# EAGLE design Top pHAT (EAGLE 9.5.2)
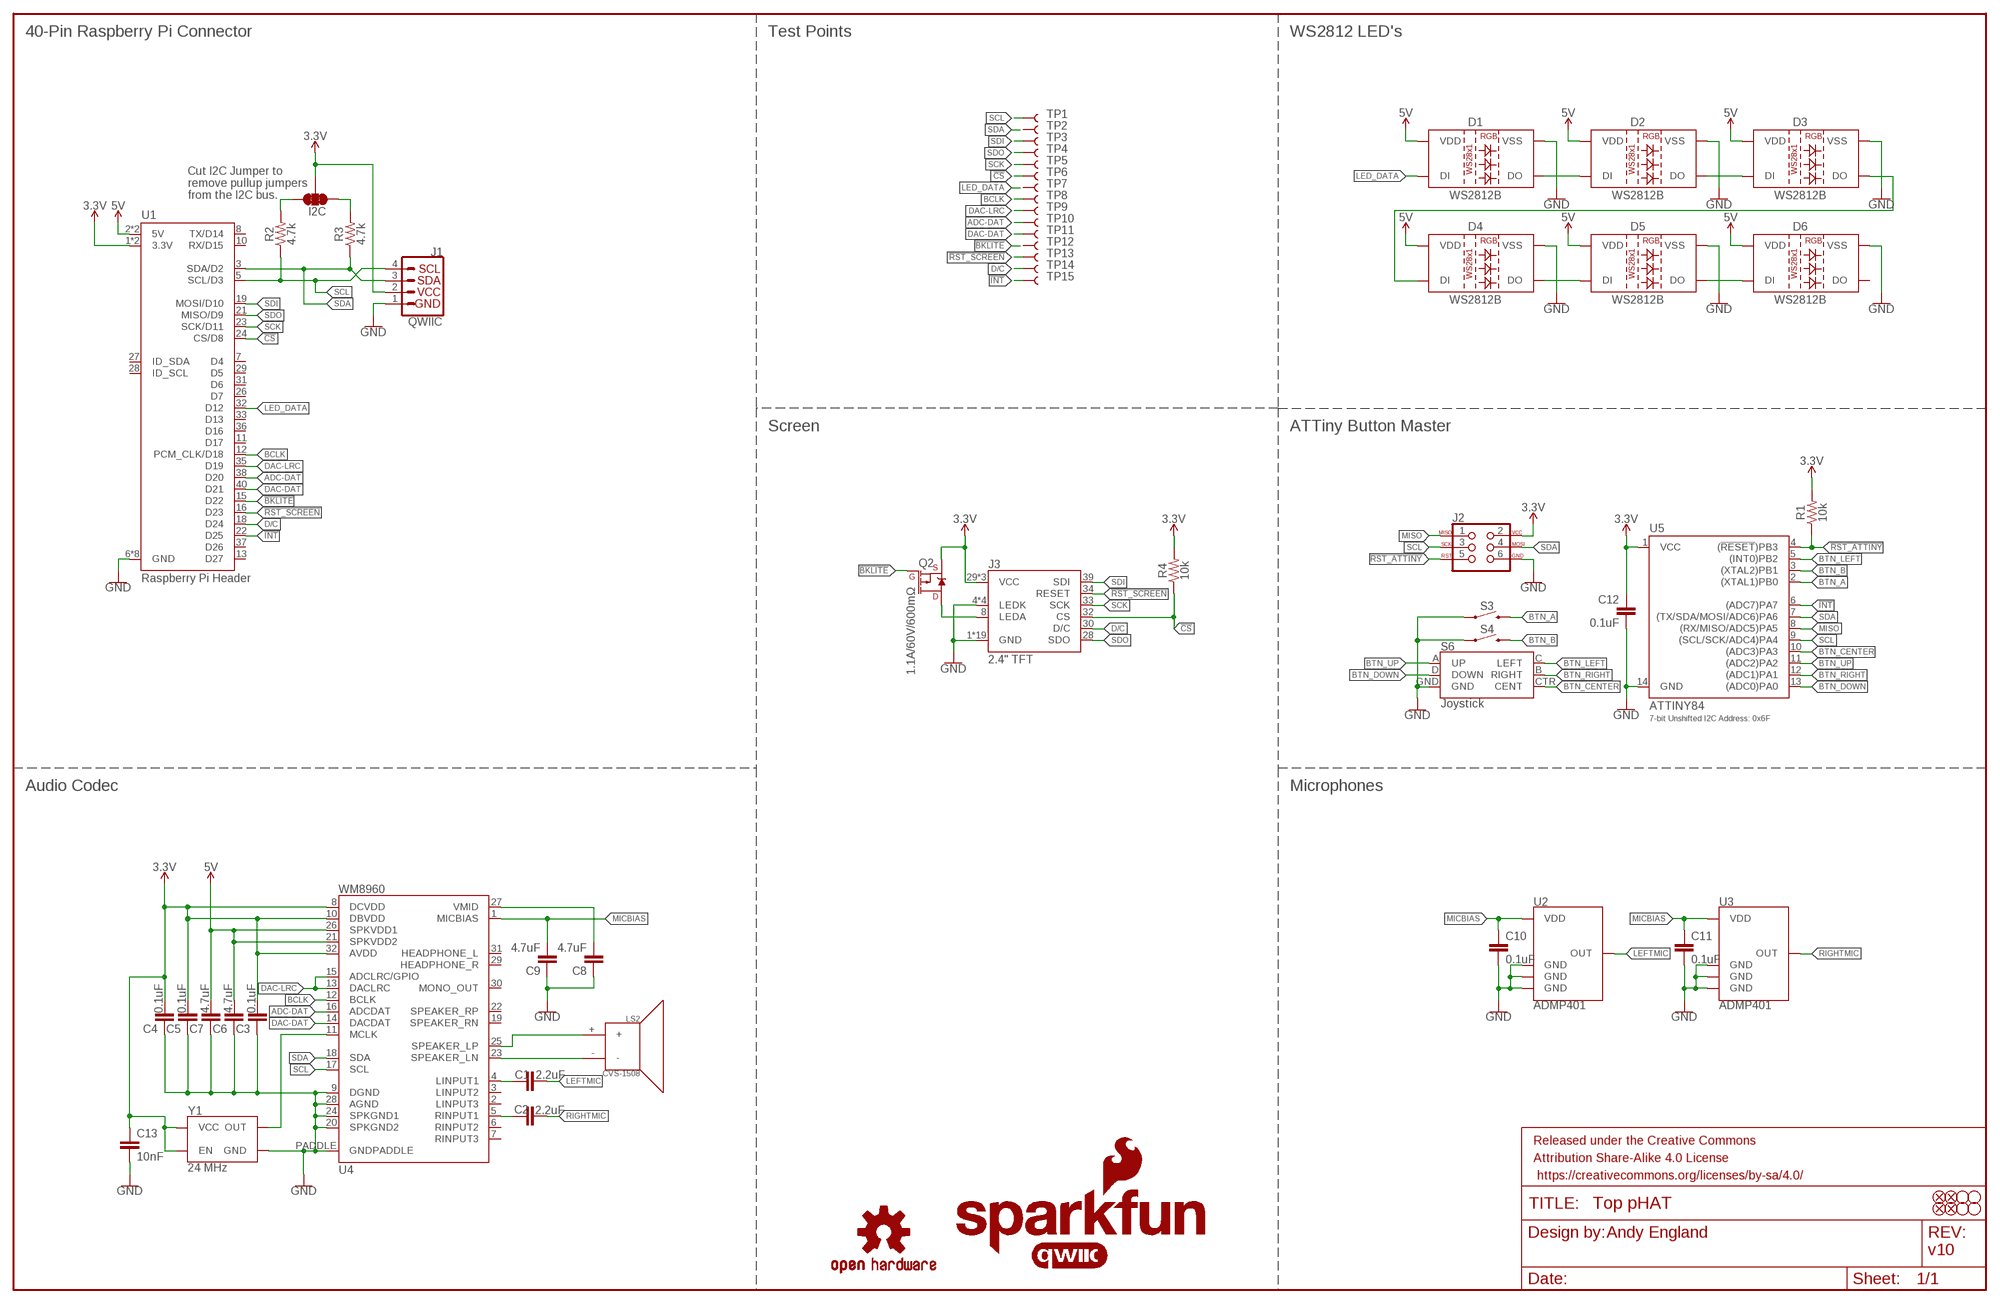
[diagram p0: schematic, sheet 1]

## Parts
C1  2.2uF  2.2UF-0603-10V-20%  [0603]
C2  2.2uF  2.2UF-0603-10V-20%  [0603]
C3  0.1uF  0.1UF-0603-25V-(+80/-20%)  [0603]
C4  0.1uF  0.1UF-0603-25V-(+80/-20%)  [0603]
C5  0.1uF  0.1UF-0603-25V-(+80/-20%)  [0603]
C6  4.7uF  4.7UF-0603-6.3V-(10%)  [0603]
C7  4.7uF  4.7UF-0603-6.3V-(10%)  [0603]
C8  4.7uF  4.7UF-0603-6.3V-(10%)  [0603]
C9  4.7uF  4.7UF-0603-6.3V-(10%)  [0603]
C10  0.1uF  0.1UF-0603-25V-(+80/-20%)  [0603]
C11  0.1uF  0.1UF-0603-25V-(+80/-20%)  [0603]
C12  0.1uF  0.1UF-0603-25V-(+80/-20%)  [0603]
C13  10nF  10NF-0603-50V-10%  [0603]
D1  WS2812B  [WS2812B]
D2  WS2812B  [WS2812B]
D3  WS2812B  [WS2812B]
D4  WS2812B  [WS2812B]
D5  WS2812B  [WS2812B]
D6  WS2812B  [WS2812B]
FD1  FIDUCIAL1X2  [FIDUCIAL-1X2]
FD2  FIDUCIAL1X2  [FIDUCIAL-1X2]
FD3  FIDUCIAL1X2  [FIDUCIAL-1X2]
FD4  FIDUCIAL1X2  [FIDUCIAL-1X2]
FRAME1  FRAME-LEDGER  [CREATIVE_COMMONS]
H1  STAND-OFFTIGHT  [STAND-OFF-TIGHT]
H2  STAND-OFFTIGHT  [STAND-OFF-TIGHT]
H3  STAND-OFFTIGHT  [STAND-OFF-TIGHT]
H4  STAND-OFFTIGHT  [STAND-OFF-TIGHT]
I2C  JUMPER-SMT_3_2-NC_TRACE_NO-SILK  [SMT-JUMPER_3_2-NC_TRACE_NO-SILK]
J1  QWIIC  QWIIC_CONNECTORJS-1MM  [JST04_1MM_RA]
J2  AVR_SPI_PROG_3X2TESTPOINTS  [2X3_TEST_POINTS]
J3  2.4" TFT  4DLCD-24-320X240  [FPC05040-17204]
LOGO2  SFE_LOGO_NAME_FLAME.4_INCH  [SFE_LOGO_NAME_FLAME_.4]
LOGO3  QWIIC_LOGO_4MM  [QWIIC_4MM]
LOGO4  OSHW-LOGOS  [OSHW-LOGO-S]
LS2  CVS-1508  SPEAKERCVS-1508  [CVS-1508_PCBSPKR]
Q2  1.1A/60V/600mΩ  MOSFET_PCH-SI2309DS  [SOT23-3]
R1  10k  10KOHM-0603-1/10W-1%  [0603]
R2  4.7k  4.7KOHM-0603-1/10W-1%  [0603]
R3  4.7k  4.7KOHM-0603-1/10W-1%  [0603]
R4  10k  10KOHM-0603-1/10W-1%  [0603]
S3  MOMENTARY-SWITCH-SPST-SMD-5.2MM-TALL  [TACTILE_SWITCH_SMD_5.2MM]
S4  MOMENTARY-SWITCH-SPST-SMD-5.2MM-TALL  [TACTILE_SWITCH_SMD_5.2MM]
S6  Joystick  JOYSTICK_MINI  [JOYSTICK_MINI]
TP1  TEST-POINT3X5  [PAD.03X.05]
TP2  TEST-POINT3X5  [PAD.03X.05]
TP3  TEST-POINT3X5  [PAD.03X.05]
TP4  TEST-POINT3X5  [PAD.03X.05]
TP5  TEST-POINT3X5  [PAD.03X.05]
TP6  TEST-POINT3X5  [PAD.03X.05]
TP7  TEST-POINT3X5  [PAD.03X.05]
TP8  TEST-POINT3X5  [PAD.03X.05]
TP9  TEST-POINT3X5  [PAD.03X.05]
TP10  TEST-POINT3X5  [PAD.03X.05]
TP11  TEST-POINT3X5  [PAD.03X.05]
TP12  TEST-POINT3X5  [PAD.03X.05]
TP13  TEST-POINT3X5  [PAD.03X.05]
TP14  TEST-POINT3X5  [PAD.03X.05]
TP15  TEST-POINT3X5  [PAD.03X.05]
U1  Raspberry Pi Header  RASPBERRY_PI_40BTM-NOHOLES  [RASPBERRY_PI_SHIELD_BOTTOM_ENTRY_NOHOLES]
U2  ADMP401  [ADMP401]
U3  ADMP401  [ADMP401]
U4  WM8960  [QFN-32]
U5  ATTINY84  [SO14]
Y1  24 MHz  OSCILLATOR-24MHZ  [RESONATOR-SMD-3.2X2.5]

## Nets
3.3V: C3.2 C4.2 C5.2 C12.1 C13.1 I2C.2 J1.2 J2.2 J3.29(VCC) J3.31(VCC) J3.38(VCC) Q2.2(S) R1.2 R4.2 U1.1(3.3V) U1.17(3.3V) U4.8(DCVDD) U4.10(DBVDD) U4.32(AVDD) U5.1(VCC) Y1.1(EN) Y1.4(VCC)
5V: C6.2 C7.2 D1.1(VDD) D2.1(VDD) D3.1(VDD) D4.1(VDD) D5.1(VDD) D6.1(VDD) U1.2(5V) U1.4(5V) U4.21(SPKVDD2) U4.26(SPKVDD1)
!BKLITE: Q2.1(G) TP12.P$1 U1.15(D22)
!CS: J3.32(CS) R4.1 TP6.P$1 U1.24(CS/D8)
!INT: TP15.P$1 U1.22(D25) U5.6((ADC7)PA7)
!RST_ATTINY: J2.5 R1.1 U5.4((!RESET!)PB3)
!RST_SCREEN: J3.34(RESET) TP13.P$1 U1.16(D23)
ADC-DAT: TP10.P$1 U1.38(D20) U4.16(ADCDAT)
BCLK: TP8.P$1 U1.12(PCM_CLK/D18) U4.12(BCLK)
BTN_A: S3.3 U5.2((XTAL1)PB0)
BTN_B: S4.3 U5.3((XTAL2)PB1)
BTN_CENTER: S6.CTR(CENT) U5.10((ADC3)PA3)
BTN_DOWN: S6.D(DOWN) U5.13((ADC0)PA0)
BTN_LEFT: S6.C(LEFT) U5.5((INT0)PB2)
BTN_RIGHT: S6.B(RIGHT) U5.12((ADC1)PA1)
BTN_UP: S6.A(UP) U5.11((ADC2)PA2)
D/C: J3.30(D/C) TP14.P$1 U1.18(D24)
DAC-DAT: TP11.P$1 U1.40(D21) U4.14(DACDAT)
DAC-LRC: TP9.P$1 U1.35(D19) U4.13(DACLRC) U4.15(ADCLRC/GPIO)
GND: C3.1 C4.1 C5.1 C6.1 C7.1 C8.1 C9.1 C10.2 C11.2 C12.2 C13.2 D1.3(VSS) D2.3(VSS) D3.3(VSS) D4.3(VSS) D5.3(VSS) D6.3(VSS) J1.1 J2.6 J3.1(GND) J3.4(LEDK) J3.5(LEDK) J3.6(LEDK) J3.7(LEDK) J3.11(GND) J3.12(GND) J3.13(GND) J3.14(GND) J3.15(GND) J3.16(GND) J3.17(GND) J3.18(GND) J3.19(GND) J3.20(GND) J3.21(GND) J3.22(GND) J3.23(GND) J3.24(GND) J3.25(GND) J3.26(GND) J3.27(GND) J3.40(GND) S3.1 S4.1 S6.GND U1.6(GND) U1.9(GND) U1.14(GND) U1.20(GND) U1.25(GND) U1.30(GND) U1.34(GND) U1.39(GND) U2.2(GND) U2.4(GND) U2.6(GND) U3.2(GND) U3.4(GND) U3.6(GND) U4.9(DGND) U4.20(SPKGND2) U4.24(SPKGND1) U4.28(AGND) U4.PADDLE(GNDPADDLE) U5.14(GND) Y1.2(GND)
LED_DATA: D1.4(DI) TP7.P$1 U1.32(D12)
LEFTMIC: C1.2 U2.1(OUT)
MICBIAS: C9.2 C10.1 C11.1 U2.5(VDD) U3.5(VDD) U4.1(MICBIAS)
MISO: J2.1 U5.8((RX/MISO/ADC5)PA5)
N$1: D3.2(DO) D4.4(DI)
N$2: D4.2(DO) D5.4(DI)
N$3: D5.2(DO) D6.4(DI)
N$4: J3.8(LEDA) Q2.3(D)
N$6: LS2.+ U4.25(SPEAKER_LP)
N$8: D1.2(DO) D2.4(DI)
N$9: D2.2(DO) D3.4(DI)
N$11: U4.11(MCLK) Y1.3(OUT)
N$16: I2C.3 R2.2
N$17: I2C.1 R3.2
N$22: LS2.- U4.23(SPEAKER_LN)
N$29: C1.1 U4.4(LINPUT1)
N$30: C2.1 U4.5(RINPUT1)
N$38: C8.2 U4.27(VMID)
RIGHTMIC: C2.2 U3.1(OUT)
SCK: J3.33(SCK) TP5.P$1 U1.23(SCK/D11)
SCL: J1.4 J2.3 R2.1 TP1.P$1 U1.5(SCL/D3) U4.17(SCL) U5.9((SCL/SCK/ADC4)PA4)
SDA: J1.3 J2.4 R3.1 TP2.P$1 U1.3(SDA/D2) U4.18(SDA) U5.7((TX/SDA/MOSI/ADC6)PA6)
SDI: J3.39(SDI) TP3.P$1 U1.19(MOSI/D10)
SDO: J3.28(SDO) TP4.P$1 U1.21(MISO/D9)
Unconnected: D6.2(DO) U1.7(D4) U1.8(TX/D14) U1.10(RX/D15) U1.11(D17) U1.13(D27) U1.26(D7) U1.27(ID_SDA) U1.28(ID_SCL) U1.29(D5) U1.31(D6) U1.33(D13) U1.36(D16) U1.37(D26) U4.2(LINPUT3) U4.3(LINPUT2) U4.6(RINPUT2) U4.7(RINPUT3) U4.19(SPEAKER_RN) U4.22(SPEAKER_RP) U4.29(HEADPHONE_R) U4.30(MONO_OUT) U4.31(HEADPHONE_L)

## Notes on the sheet
- 40-Pin Raspberry Pi Connector | Test Points | WS2812 LED's
- Cut I2C Jumper to 
  remove pullup jumpers 
  from the I2C bus.
- Screen | ATTiny Button Master
- 7-bit Unshifted I2C Address: 0x6F
- Audio Codec | Microphones
- Andy England
- v10

## Library data of the parts
C1 C2 = SparkFun-Capacitors:2.2UF: 2.2µF ceramic capacitors A capacitor is a passive two-terminal electrical component used to store electrical energy temporarily in an electric field.; PROD_ID: CAP-07888
C3-C5 C10-C12 = SparkFun-Capacitors:0.1UF: 0.1µF ceramic capacitors A capacitor is a passive two-terminal electrical component used to store electrical energy temporarily in an electric field.; PROD_ID: CAP-00810
C6-C9 = SparkFun-Capacitors:4.7UF: 4.7µF ceramic capacitors A capacitor is a passive two-terminal electrical component used to store electrical energy temporarily in an electric field.; PROD_ID: CAP-08280
C13 = SparkFun-Capacitors:10NF: 0.01uF/10nF/10,000pF ceramic capacitors A capacitor is a passive two-terminal electrical component used to store electrical energy temporarily in an electric field. CAP-09321; PROD_ID: CAP-00867
D1-D6 = SparkFun-LED:WS2812B: WS2812B SMD addressable RGB LED 5x5mm SMD LED with built-in controller IC. Color: Red/Green/Blue mC Rating: RGB: 390, 660, 180 mcd Forward Voltage: RGB: 2.0, 3.0, 3.0 V Packages:WS2812B SparkFun Products: Blynk Board - ESP8266 <https://www.sparkfun.com/products/13794>; PROD_ID: DIO-12503
FD1-FD4 = SparkFun-Aesthetics:FIDUCIAL: Fiducial Alignment Points Point-of-reference for pick-and-place machines and other optical instruments.
FRAME1 = SparkFun-Aesthetics:FRAME-LEDGER: Schematic Frame - Ledger Standard 11x14 US Ledger frame
H1-H4 = SparkFun-Hardware:STAND-OFF: Stand Off Drill holes for mechanically mounting via screws, standoffs, etc. Note: Use the keepout ring to avoid running the screw head into surrounding components. Variant Overviews STAND-OFF - Mechanical footprint for a #4 phillips button head screw. STAND-OFF-TIGHT - Mechanical footprint for a #4 phillips button head screw, Example SparkFun Products Screw - Phillips Head (1/4", 4-40, 10 pack) <https://www.sparkfun.com/products/10453> (PRT-10453) Screw - Phillips Head (1/2", 4-40, 10 pack) <https://www.sparkfun.com/products/10452> (PRT-10452) Screw - Phillips Head (3/4", 4-40, 10 pack) <https://www.sparkfun.com/products/10451> (PRT-10451) Screw - Phillips Head (1", 4-40, 10 pack) <https://www.sparkfun.com/products/10450> (PRT-10450)
I2C = SparkFun-Jumpers:JUMPER-SMT_3_2-NC_TRACE: Normally closed trace jumper (2 of 2 connections) This jumper has a trace between all three pads so they are normally closed (NC). Use a razor knife to open the connection(s). For best results follow the IPC guidelines for cutting traces: Cutout at least 0.063 mm (0.005 in). Remove all loose material to clean up the cut area. Seal the cut with an approved epoxy. Reapply solder to reclose the connection(s).
J1 = SparkFun-Connectors:QWIIC_CONNECTOR: SparkFun I2C Standard Qwiic Connector An SMD 1mm pitch JST connector makes it easy and quick (get it? Qwiic?) to connect I2C devices to each other. The Qwiic system <http://www.sparkfun.com/qwiic> enables fast and solderless connection between popular platforms and various sensors and actuators. We carry 200mm <https://www.sparkfun.com/products/14204>, 100mm <https://www.sparkfun.com/products/14205>, 50mm <https://www.sparkfun.com/products/14206>, and breadboard friendly <https://www.sparkfun.com/products/14207> Qwiic cables. We also offer 10 pcs strips <https://www.sparkfun.com/products/14323> the SMD connectors.; PROD_ID: CONN-13694; VALUE: QWIIC_RIGHT_ANGLE
J2 = SparkFun-Connectors:AVR_SPI_PROG_3X2: AVR ISP 6 Pin This is the reduced ISP connector for AVR programming. Common on Arduino. This footprint will take up less PCB space and can be used with a 10-pin to 6-pin adapter such as SKU: BOB-08508 **Special note about "TEST_POINT" package. The stop mask is on the top side, so if you want your programming test points to be on the bottom of your board, make sure to place this package on the bottom side of the board. This also ensure that the orientation to program from the bottom side will be correct. SparkFun Products: SparkFun ISP Pogo Adapter <https://www.sparkfun.com/products/11591> - NS Tiny AVR Programmer <https://www.sparkfun.com/products/11801> -PTH
J3 = SparkFun-Displays:4DLCD-24-320X240: 4D LCD 4DLCD-24320240-IPS - 2.4" 240x320 TFT LCD 4-wire SPI capable TFT display. 36.72 x 48.96mm active area; PROD_ID: LCD-14913; PROD_ID1: CONN-14082
LOGO2 = SparkFun-Aesthetics:SFE_LOGO_NAME_FLAME: SparkFun Font Logo w/ Flame This is the SparkFun full logo. The logo on the schematic will always be the same size; the package variant is the height of the flame part of the logo. Default layer for the logo on the board is tSilk.
LOGO3 = SparkFun-Aesthetics:QWIIC_LOGO: Qwiic Logos for placement on schematic and PCB. The 5.5mm silk logo is best for placing next to Qwiic connector.
LOGO4 = SparkFun-Aesthetics:OSHW-LOGO: Open-Source Hardware (OSHW) Logo This logo indicates the piece of hardware it is found on incorporates a OSHW license and/or adheres to the definition of open source hardware found here: http://freedomdefined.org/OSHW
LS2 = SparkFun-Electromechanical:SPEAKER: Speaker Generic 2-terminal loudspeakers SparkFun Products Speaker - PCB Mount <https://www.sparkfun.com/products/11089> (COM-11089); PROD_ID: COM-14823
Q2 = SparkFun-DiscreteSemi:MOSFET_PCH: P-channel MOSFETs Voltage controlled devices that allow control of high current outputs. SparkFun Products: SparkFun ESP32 Thing <https://www.sparkfun.com/products/13907> SparkFun ESP8266 Thing <https://www.sparkfun.com/products/13231> SparkFun Pi Servo HAT V2 <https://www.sparkfun.com/products/15316> DMG2305UX-7 (20V/4.2A/SOT23-3); PROD_ID: TRANS-08285
R1 R4 = SparkFun-Resistors:10KOHM: 10kΩ resistor A resistor is a passive two-terminal electrical component that implements electrical resistance as a circuit element. Resistors act to reduce current flow, and, at the same time, act to lower voltage levels within circuits. - Wikipedia; PROD_ID: RES-00824
R2 R3 = SparkFun-Resistors:4.7KOHM: 4.7kΩ resistor A resistor is a passive two-terminal electrical component that implements electrical resistance as a circuit element. Resistors act to reduce current flow, and, at the same time, act to lower voltage levels within circuits. - Wikipedia; PROD_ID: RES-07857
S3 S4 = SparkFun-Switches:MOMENTARY-SWITCH-SPST: Momentary Switch (Pushbutton) - SPST Normally-open (NO) SPST momentary switches (buttons, pushbuttons). Variants PTH-12MM - 12mm square, through-hole Momentary Pushbutton Switch - 12mm Square <https://www.sparkfun.com/products/9190> (COM-09190) PTH-6.0MM, PTH-6.0MM-KIT - 6.0mm square, through-hole Mini Pushbutton Switch <https://www.sparkfun.com/products/97> (COM-00097) KIT package intended for soldering kit's - only one side of pads' copper is exposed. PTH-RIGHT-ANGLE-KIT - Right-angle, through-hole Right Angle Tactile Button <https://www.sparkfun.com/products/10791> - Used on SparkFun BigTime Watch Kit <https://www.sparkfun.com/products/11734> SMD-12MM - 12mm square, surface-mount Tactile Button - SMD (12mm) <https://www.sparkfun.com/products/12993> (COM-12993) Used on SparkFun PicoBoard <https://www.sparkfun.com/products/11888> SMD-4.5MM - 4.5mm Square Trackball Switch Used on SparkFun Blackberry Trackballer Breakout <https://www.sparkfun.com/products/13169> SMD-4.6MMX2.8MM - 4.60mm x 2.80mm, surface mount Used on SparkFun SAMD21 Mini Breakout <https://www.sparkfun.com/products/13664> SMD-5.2MM, SMD-5.2-REDUNDANT - 5.2mm square, surface-mount Mini Pushbutton Switch - SMD <https://www.sparkfun.com/products/8720> (COM-08720) Used on Arduino Pro Mini <https://www.sparkfun.com/products/11114> REDUNDANT package connects both switch circuits together SMD-6.0X3.5MM - 6.0 x 3.5mm, surface mount Momentary Reset Switch SMD <https://www.sparkfun.com/products/8229> (COM-08229) SMD-6.2MM-TALL - 6.2mm square, surface mount Tactile Button - SMD (6mm) <https://www.sparkfun.com/products/12992> Used on SparkFun Digital Sandbox <https://www.sparkfun.com/products/12651> SMD-RIGHT-ANGLE - Right-angle, surface mount Used on SparkFun Block for Intel® Edison - Arduino <https://www.sparkfun.com/products/13036>; PROD_ID: SWCH-14139
S6 = SparkFun-Switches:JOYSTICK_MINI: Small Tactile Joystick w/ Select Switch A 5-way tactile switch allows for a joystick-like interface in a very small package. Part #: 4UCON SF303GJ26 SparkFun Products 5-way Tactile Switch <https://www.sparkfun.com/products/10063> (COM-10063) Used on SparkFun Block for Intel® Edison - OLED <https://www.sparkfun.com/products/13035> (DEV-13035) Used on CAN-BUS Shield <https://www.sparkfun.com/products/13262> (DEV-13262); PROD_ID: SWCH-09905; SF_SKU: COM-10063
TP1-TP15 = SparkFun-Connectors:TEST-POINT: SparkFun Test Points Bare copper test points for troubleshooting or In-Circuit-Testing. These are used by our Production team for verifying production board runs using pogo-pins on test beds. SparkFun Products: SparkFun LSM9DS1 Breakout <https://www.sparkfun.com/products/13284> SparkFun PSOC <https://www.sparkfun.com/products/13714> SparkFun Load Cell Amplifier <https://www.sparkfun.com/products/13879>
U1 = SparkFun-Connectors:RASPBERRY_PI_40; PROD_ID: CONN-13790
U2 U3 = SparkFun-Sensors:ADMP401: ADMP401 - Omnidirection Bottom-Port MEMS Microphone The ADMP401 is a high quality, low cost, low power analog output bottom-ported omnidirectional MEMS microphone. The ADMP401 consists of a MEMS microphone element, an impedance converter, and an output amplifier. The ADMP401 sensitivity specification makes it an excellent choice for both near field and far field applications. Datasheet <http://www.analog.com/media/en/technical-documentation/obsolete-data-sheets/ADMP401.pdf> SparkFun Products SparkFun MEMS Microphone Breakout - INMP401 (ADMP401) <https://www.sparkfun.com/products/9868> (BOB-09868) MEMS Microphone - INMP401 (ADMP401) <https://www.sparkfun.com/products/10028> (COM-10028); PROD_ID: IC-09773
U4 = SparkFun-IC-Special-Function:WM8960: Cirrus Logic WM890 - Stereo Audio CODEC I2S enabled audio CODEC with stereo microphone input ADC's and stereo audio output DAC's. Onboard 1W Class D Speaker driver is also capable of driving an 8 Ohm speaker. Also has an onboard headphone driver.; PROD_ID: IC-14824
U5 = SparkFun-IC-Microcontroller:ATTINY84: Atmel 14-pin 2/4/8kB flash uC Datasheet <https://cdn.sparkfun.com/datasheets/Widgets/doc8006.pdf> SparkFun Products Tiny AVR Programmer <https://www.sparkfun.com/products/11801> (PGM-11801) SparkFun Servo Trigger - Continuous Rotation <https://www.sparkfun.com/products/13872> (WIG-13872) SparkFun Servo Trigger <https://www.sparkfun.com/products/13118> (WIG-13118); PROD_ID: IC-11285
Y1 = SparkFun-Clocks:OSCILLATOR-24MHZ: Abracon 24 MHZ Oscillator 3.3V - 50 PPM - 15 pF - 24 MHz Oscillator; PROD_ID: XTAL-14907

## Board
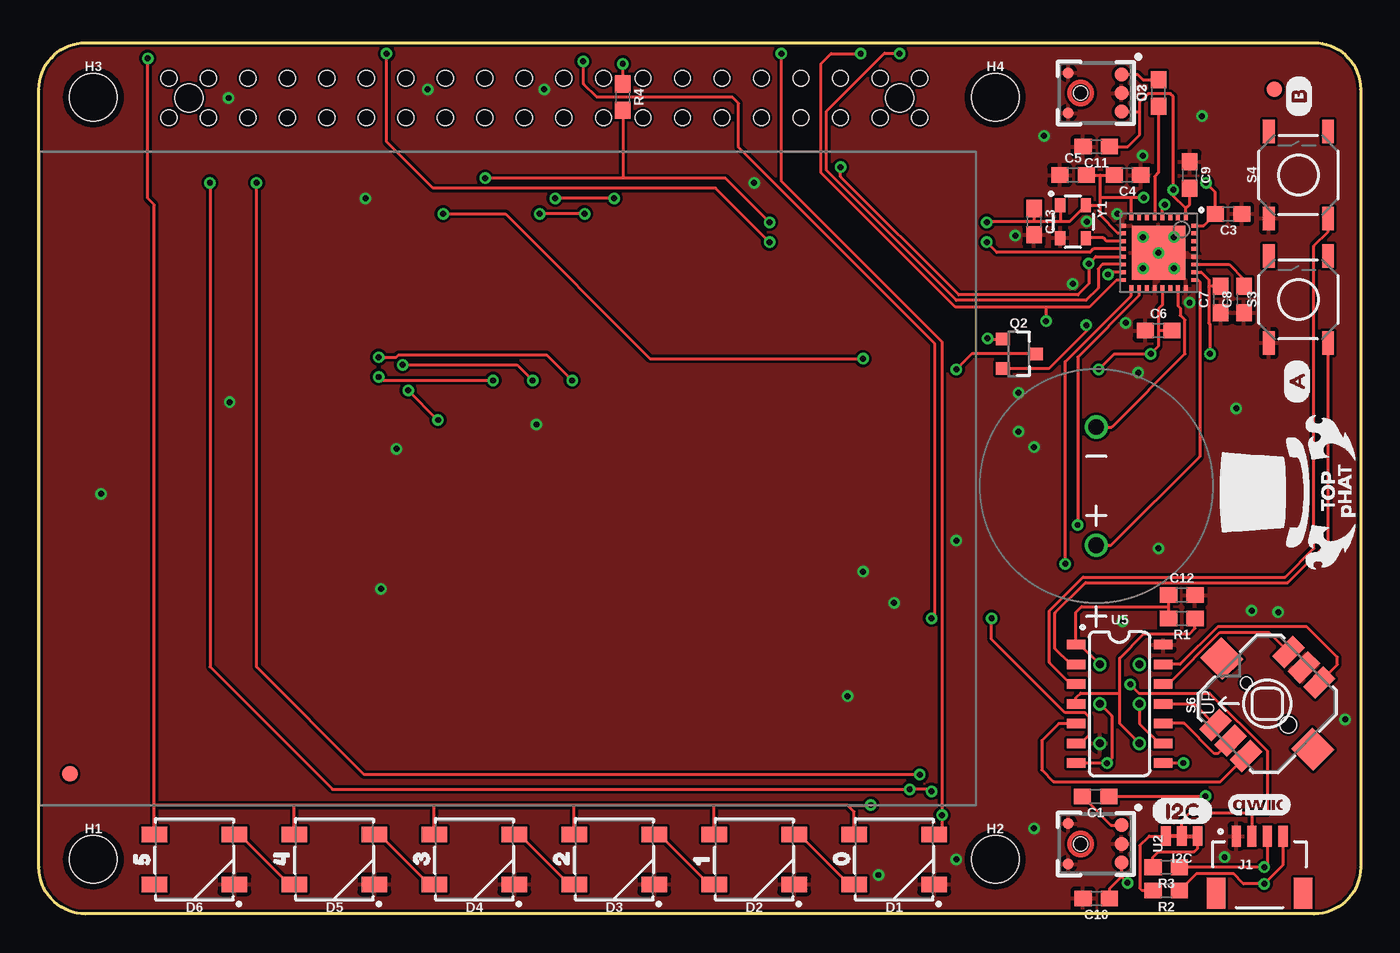
[diagram p1: board, top side]
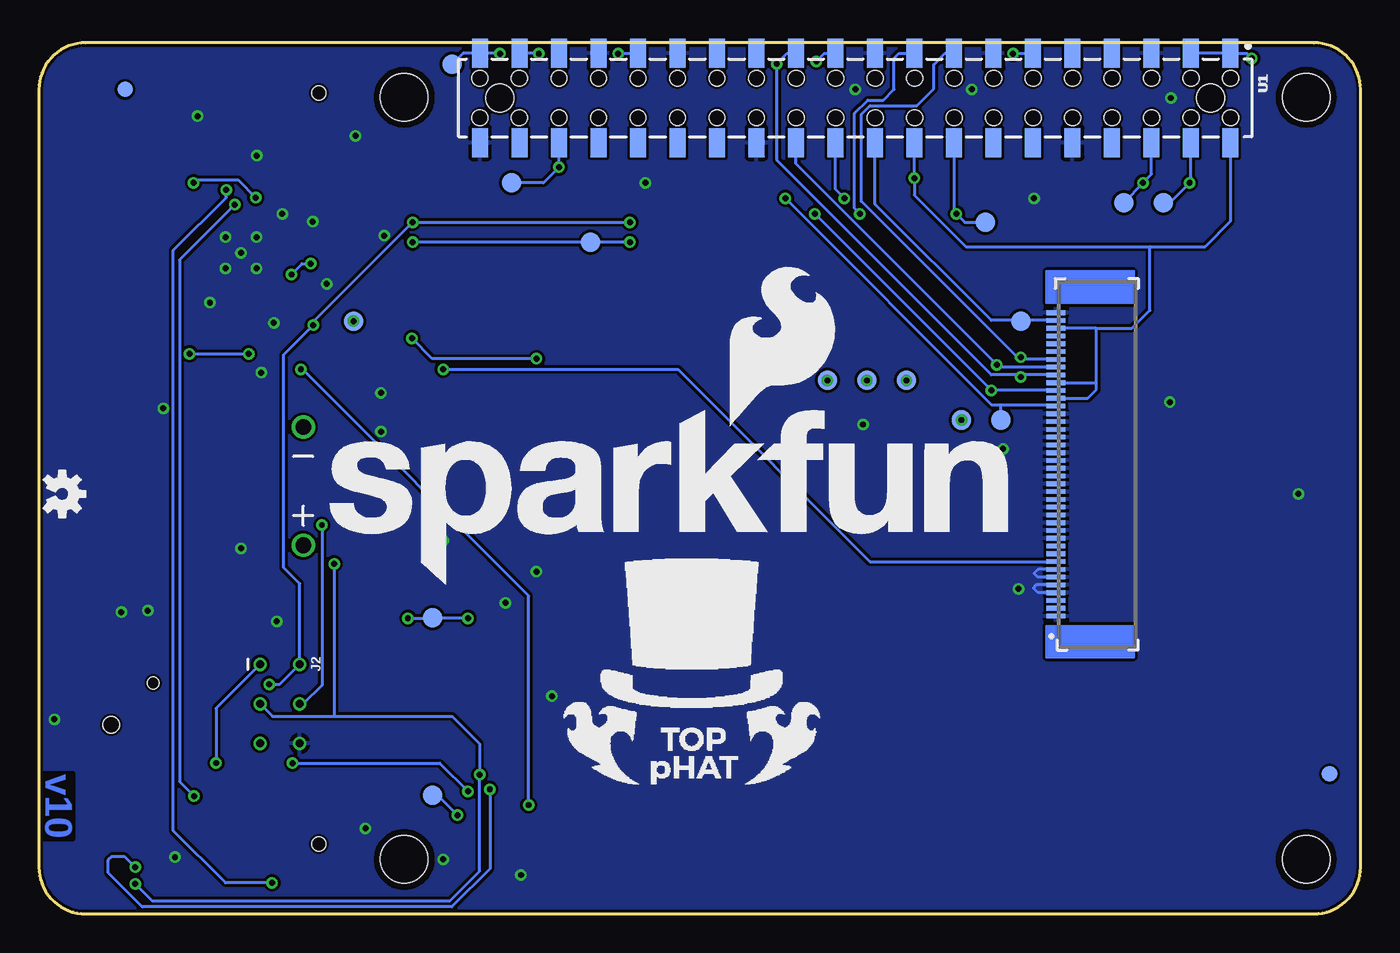
[diagram p2: board, bottom side, seen from below]

Size 85 x 56 mm. Coordinates in mm from the lower left corner, seen from the top.
Outline: 3,0 arc-90 0,3 0,53 arc-90 3,56 82,56 arc-90 85,53 85,3 arc-90 82,0 3,0
Copper layers (1*16): Top 0.035mm / dielectric 1.5mm / Bottom 0.035mm
Design rules "SparkFun-2-layer-TIGHT": minimum track width 7mil, minimum drill 15mil, track to track 7mil, track to pad 7mil, pad to pad 7mil, via to via 7mil, smd to smd 7mil, copper to edge 7mil, drill to drill 7mil, minimum pad ring 7mil, minimum via ring 7mil, stop-mask expansion 4mil, vias tented up to drill 25mil, thermal gap 10mil

### Footprints (pad centres in the part's own frame; a part is rotated, then mirrored left to right if it is on the bottom)
0603 = smd 1.1 x 1: 1 -0.85,0; 2 0.85,0
WS2812B = smd 1.651 x 1: 1 2.577,-1.6; 2 2.577,1.6; 3 -2.577,1.6; 4 -2.577,-1.6
FIDUCIAL-1X2 = smd 1 x 1: 1 0,0
STAND-OFF-TIGHT = hole 3.048: 0,0
SMT-JUMPER_3_2-NC_TRACE_NO-SILK = smd 0.635 x 1.27: 1 -1.016,0; 2 0,0; 3 1.016,0
JST04_1MM_RA = smd 0.6 x 1.35: 1 -1.5,0; 2 -0.5,0; 3 0.5,0; 4 1.5,0 | smd 1.2 x 2: NC1 2.8,-3.675; NC2 -2.8,-3.675
2X3_TEST_POINTS = drill 0.508: 1 -2.54,-1.27; 2 -2.54,1.27; 3 0,-1.27; 4 0,1.27; 5 2.54,-1.27; 6 2.54,1.27
FPC05040-17204 = smd 0.3 x 1.2: 1 -9.75,0.6; 2 -9.25,0.6; 3 -8.75,0.6; 4 -8.25,0.6; 5 -7.75,0.6; 6 -7.25,0.6; 7 -6.75,0.6; 8 -6.25,0.6; 9 -5.75,0.6; 10 -5.25,0.6; 11 -4.75,0.6; 12 -4.25,0.6; 13 -3.75,0.6; 14 -3.25,0.6; 15 -2.75,0.6; 16 -2.25,0.6; 17 -1.75,0.6; 18 -1.25,0.6; 19 -0.75,0.6; 20 -0.25,0.6; 21 0.25,0.6; 22 0.75,0.6; 23 1.25,0.6; 24 1.75,0.6; 25 2.25,0.6; 26 2.75,0.6; 27 3.25,0.6; 28 3.75,0.6; 29 4.25,0.6; 30 4.75,0.6; 31 5.25,0.6; 32 5.75,0.6; 33 6.25,0.6; 34 6.75,0.6; 35 7.25,0.6; 36 7.75,0.6; 37 8.25,0.6; 38 8.75,0.6; 39 9.25,0.6; 40 9.75,0.6
CVS-1508_PCBSPKR = drill 1: + 0,3.8; - 0,-3.8
SOT23-3 = smd 0.8 x 0.9: 1 -0.95,-1; 2 0.95,-1; 3 0,1.1
TACTILE_SWITCH_SMD_5.2MM = smd 1.524 x 0.762: 1 -2.794,1.905; 2 2.794,1.905; 3 -2.794,-1.905; 4 2.794,-1.905
JOYSTICK_MINI = smd 1.85 x 1.1: A -3.325,1.4; B 3.325,1.4; C -3.325,-1.4; CTR -3.325,0; D 3.325,-1.4; GND 3.325,0 | smd 1.9 x 2: NC 0,4.13; NC@0 0,-4.13 | hole 0.75: 0,1.9 | hole 1.05: 0,-1.9
PAD.03X.05 = smd 1.27 x 1.27: P$1 0,0
RASPBERRY_PI_SHIELD_BOTTOM_ENTRY_NOHOLES = smd 1.02 x 1.87: 1 8.37,7.665; 2 8.37,1.935; 3 10.91,7.665; 4 10.91,1.935; 5 13.45,7.665; 6 13.45,1.935; 7 15.99,7.665; 8 15.99,1.935; 9 18.53,7.665; 10 18.53,1.935; 11 21.07,7.665; 12 21.07,1.935; 13 23.61,7.665; 14 23.61,1.935; 15 26.15,7.665; 16 26.15,1.935; 17 28.69,7.665; 18 28.69,1.935; 19 31.23,7.665; 20 31.23,1.935; 21 33.77,7.665; 22 33.77,1.935; 23 36.31,7.665; 24 36.31,1.935; 25 38.85,7.665; 26 38.85,1.935; 27 41.39,7.665; 28 41.39,1.935; 29 43.93,7.665; 30 43.93,1.935; 31 46.47,7.665; 32 46.47,1.935; 33 49.01,7.665; 34 49.01,1.935; 35 51.55,7.665; 36 51.55,1.935; 37 54.09,7.665; 38 54.09,1.935; 39 56.63,7.665; 40 56.63,1.935 | hole 1.02: 31.23,6.07; 31.23,3.53; 28.69,3.53; 28.69,6.07; 26.15,6.07; 26.15,3.53; 23.61,3.53; 23.61,6.07; 36.31,6.07; 36.31,3.53; 33.77,3.53; 33.77,6.07; 15.99,6.07; 15.99,3.53; 13.45,3.53; 13.45,6.07; 10.91,6.07; 10.91,3.53; 8.37,3.53; 8.37,6.07; 21.07,6.07; 21.07,3.53; 18.53,3.53; 18.53,6.07; 46.47,6.07; 46.47,3.53; 43.93,3.53; 43.93,6.07; 41.39,6.07; 41.39,3.53; 38.85,3.53; 38.85,6.07; 51.55,6.07; 51.55,3.53; 49.01,3.53; 49.01,6.07; 54.09,6.07; 56.63,6.07; 56.63,3.53; 54.09,3.53 | hole 1.8: 55.36,4.8; 9.64,4.8
ADMP401 = smd 0.9 x 0.9: 1 -1.2,2.62; 5 1.2,2.62; 6 0,2.62 | smd 0.7 x 0.7: 2 1.3,-0.8; 4 -1.3,-0.8 | hole 0.9: 0,0
QFN-32 = smd 0.4 x 0.25: 1 -2.3,1.75; 2 -2.3,1.25; 3 -2.3,0.75; 4 -2.3,0.25; 5 -2.3,-0.25; 6 -2.3,-0.75; 7 -2.3,-1.25; 8 -2.3,-1.75; 17 2.3,-1.75; 18 2.3,-1.25; 19 2.3,-0.75; 20 2.3,-0.25; 21 2.3,0.25; 22 2.3,0.75; 23 2.3,1.25; 24 2.3,1.75 | smd 0.25 x 0.4: 9 -1.75,-2.3; 10 -1.25,-2.3; 11 -0.75,-2.3; 12 -0.25,-2.3; 13 0.25,-2.3; 14 0.75,-2.3; 15 1.25,-2.3; 16 1.75,-2.3; 25 1.75,2.3; 26 1.25,2.3; 27 0.75,2.3; 28 0.25,2.3; 29 -0.25,2.3; 30 -0.75,2.3; 31 -1.25,2.3; 32 -1.75,2.3 | smd 3.45 x 3.45: PADDLE 0,0
SO14 = smd 0.6 x 1.2: 1 -3.81,-2.8; 2 -2.54,-2.8; 3 -1.27,-2.8; 4 0,-2.8; 5 1.27,-2.8; 6 2.54,-2.8; 7 3.81,-2.8; 8 3.81,2.8; 9 2.54,2.8; 10 1.27,2.8; 11 0,2.8; 12 -1.27,2.8; 13 -2.54,2.8; 14 -3.81,2.8
RESONATOR-SMD-3.2X2.5 = smd 0.9 x 0.65: 1 -1.05,-0.825; 2 1.05,-0.825; 3 1.05,0.825; 4 -1.05,0.825

### Placement (x,y rotation side)
C1  67.95,7.55 180 top
C2  72,52.77 90 top
C3  76.5,45 180 top
C4  70,47.5 180 top
C5  66.5,47.5 0 top
C6  72,37.5 0 top
C7  76,39.5 90 top
C8  77.5,39.5 90 top
C9  74,47.5 270 top
C10  68,1 180 top
C11  68,49.32 180 top
C12  73.5,20.5 0 top
C13  64,44.5 270 top
D1  55,3.5 180 top
D2  46,3.5 180 top
D3  37,3.5 180 top
D4  28,3.5 180 top
D5  19,3.5 180 top
D6  10,3.5 180 top
FD1  2,9 0 top
FD2  2,9 0 bottom
FD3  79.46,53 0 top
FD4  79.46,53 0 bottom
FRAME1  12,-20 0 top  (outside the outline)
H1  3.5,3.5 0 top
H2  61.5,3.5 0 top
H3  3.5,52.5 0 top
H4  61.5,52.5 0 top
I2C  73.5,5 180 top
J1  78.5,5 0 top
J2  69.5,13.5 270 bottom
J3  19,28.9 90 bottom
LOGO2  67,21 0 bottom
LOGO3  78.5,7 0 top
LOGO4  83.5,27 270 bottom
LS2  68,27.5 180 top
Q2  63,36 270 top
R1  73.5,19 180 top
R2  72.5,1.5 180 top
R3  72.5,3 180 top
R4  37.55,52.5 270 top
S3  81,39.5 90 top
S4  81,47.5 90 top
S6  79,13.5 45 top
TP1  15.24,45.72 0 bottom
TP2  12.7,45.72 0 bottom
TP3  21.86,38.1 0 bottom
TP4  23.13,31.75 0 bottom
TP5  31.75,34.29 0 bottom
TP6  29.21,34.29 0 bottom
TP7  59.69,7.62 0 bottom
TP8  49.53,43.18 0 bottom
TP9  54.61,46.99 0 bottom
TP10  64.77,38.1 0 bottom
TP11  58.42,54.61 0 bottom
TP12  24.13,44.45 0 bottom
TP13  34.29,34.29 0 bottom
TP14  25.67,31.75 0 bottom
TP15  59.69,19.05 0 bottom
U1  0,57.25 180 bottom
U2  67,4.5 270 top
U3  67,52.77 270 top
U4  72,42.5 270 top
U5  69.5,13.5 270 top
U$1  [2020#02#27#PNG]  80.5,27 90 top
U$3  [00]  51.6,2.2 90 top
U$4  [11]  42.6,2.2 90 top
U$5  [22]  33.6,2.2 90 top
U$6  [A0]  80.9,32.77 90 top
U$7  [B1]  81.03,51.18 90 top
U$8  [I2C3]  71.51,6.6 0 top
U$9  [33]  24.6,2.2 90 top
U$10  [44]  15.6,2.2 90 top
U$11  [55]  6.6,2.2 90 top
U$12  [2020#02#27#PNG]  43.18,15.24 0 bottom
Y1  66.5,44.5 270 top

### Tracks (layer width: path | path; a pad name or v marks a point on that pad's centre or on a via)
3.3V  (via drill 0.38)
  Top 0.178: U4.32 74.9,44.25 C3.2 75.65,46.4 v75.05,47 | R1.2 72.65,19.75 | 72.65,19.75 C12.1 | 72.65,19.75 67.05,19.75 66.7,19.4 U5.1 66.96,17.31 J2.2 | v70.19,14.75 70.74,14.2 75.28,14.2 79,10.48 79,6.5 78,6.5 | 78,6.5 J1.2 | I2C.2 73.5,6 74,6.5 78,6.5 | v46.99,44.45 44.14,47.3 37.55,47.3 | 37.55,47.3 v28.7,47.3 | v71.05,46.05 70.25,46.05 | U4.8 70.25,46.05 | R4.2 37.55,47.3 | U4.10 69.4,43.75 68.25,44.9 68.25,45.5 | C5.2 68.25,47.5 | 68.25,47.5 C4.2 | 68.25,45.5 68.25,46 | 68.25,46 68.25,47.5 | 65.67,44.5 66.28,44.5 Y1.4 68.2,45.55 68.25,45.5 | Y1.1 65.67,44.5 | v60.96,44.45 61.01,44.5 64,44.5 | 65.67,44.5 64,44.5 | C13.1 64,44.5 | 68.25,46 68.3,46.05 70.25,46.05 | v67.35,37.85 67.35,37.45 64.95,35.05 Q2.2
  Bottom 0.178: J3.31 17,34.15 | U1.1 8.37,44.53 10,42.9 13.55,42.9 | 17,37.65 14.7,37.65 13.55,38.8 13.55,42.9 | 17,37.65 J3.38 | 17,34.15 17,37.65 | 13.55,42.9 25.4,42.9 28.7,46.2 v28.7,47.3 v28.69,47.31 U1.17 | v70.19,14.75 69.52,14.75 J2.2 68.23,21.23 69.25,22.25 69.25,35.95 v67.35,37.85 67.35,38.06 v60.96,44.45 v46.99,44.45 | v75.05,47 74.86,47.19 72.19,47.19 v71.05,46.05 | J3.29 17.55,33.15 17,33.7 17,34.15
5V  (via drill 0.38)
  Top 0.178: D1.1 52.42,6.58 52,7 | 52,7 43.4,7 | 43.4,7 34.4,7 | 34.4,7 25.4,7 | 25.4,7 16.4,7 | D5.1 16.42,6.98 16.4,7 | D4.1 25.42,6.98 25.4,7 | D3.1 34.42,6.98 34.4,7 | D2.1 43.42,6.98 43.4,7 | D6.1 7.42,7 | 7.42,7 7.42,45.58 7,46 v7,55 | 16.4,7 7.42,7 | 52,7 v53.5,7 | v68.15,35 69.15,36 v71.5,36 72,36.5 72,37.5 | U4.21 72.25,39.15 72,38.9 72,37.5 | C6.2 72,37.5 | U4.26 74.75,41.25 75.23,40.77 75.23,40.3 | v75.31,36 75.31,37.91 75.23,37.99 75.23,40.3 | C7.2 75.28,40.35 75.23,40.3
  Bottom 0.178: v7,55 7.32,55.31 U1.2 U1.4 | v53.5,7 53.5,20.45 68.05,35 v68.15,35 | v75.31,36 v71.5,36
!BKLITE  (via drill 0.38)
  Top 0.178: v26,45 30,45 39.3,35.7 v53,35.7 | v61,37 61.05,36.95 Q2.1
  Bottom 0.178: U1.15 26.15,45.15 v26,45 25.45,44.45 TP12.P$1 | v53,35.7 59.7,35.7 v61,37
!CS  (via drill 0.38)
  Top 0.178: R4.1 v37.55,54.65 | v21.86,34.52 22.09,34.29 TP6.P$1
  Bottom 0.178: U1.24 36.88,55.31 v37.55,54.65 37.55,48.45 23.75,34.65 J3.32 21.73,34.65 v21.86,34.52
  other vias: 29.21,34.29
!INT  (via drill 0.38)
  Top 0.178: U5.6 67.01,10.96 67.57,11.52 67.57,12.64 67.27,12.93 65.99,12.93 61.27,17.65 v61.27,19 | v57.4,19 57.6,19.2 57.6,36.67 45,49.27 45,52.1 44.6,52.5 35.88,52.5 35.03,53.35 35.03,54.77 v35,54.8
  Bottom 0.178: v35,54.8 34.48,55.31 U1.22 | v61.27,19 59.74,19 TP15.P$1 57.45,19.05 v57.4,19
!RST_ATTINY
  Top 0.178: J2.5 69.5,12.23 69.5,14.2 | 69.5,14.2 69.5,16.45 71.05,18 74,18 74.35,18.35 R1.1 | U5.4 66.7,13.9 67,14.2 69.5,14.2
!RST_SCREEN  (via drill 0.38)
  Top 0.178: v21.86,35.78 22.99,35.78 23.13,35.93 32.65,35.93 TP13.P$1
  Bottom 0.178: J3.34 21.86,35.65 | 21.86,35.65 21.95,35.65 32.11,45.81 32.11,51.4 31.55,51.96 28.54,51.96 27.45,53.05 27.45,54.6 26.73,55.31 U1.16 | 21.86,35.65 v21.86,35.78
  other vias: 34.29,34.29
ADC-DAT  (via drill 0.38)
  Top 0.178: U4.16 69.3,40.75 67.55,39 64.77,39 | 64.77,39 58.94,39 50.29,47.65 50.29,54.65 50.94,55.3 v52.85,55.3 | 64.77,39 TP10.P$1
  Bottom 0.178: v52.85,55.3 52.87,55.31 U1.38
  other vias: 64.77,38.1
BCLK  (via drill 0.38)
  Top 0.178: U4.12 67.83,42.75 67.61,42.53 61.61,42.53 v60.96,43.18 | v22.35,55.3 22.35,49.65 25.35,46.65 43.52,46.65 v46.99,43.18
  Bottom 0.178: v22.35,55.3 22.34,55.31 U1.12 | v46.99,43.18 TP8.P$1 v60.96,43.18
BTN_A
  Top 0.178: U5.2 66.36,16.04 65.35,17.05 65.35,19.35 67.3,21.3 80.3,21.3 82.91,23.91 S3.3
BTN_B
  Top 0.178: U5.3 66.38,14.77 64.99,16.16 64.99,19.5 67.15,21.66 80.15,21.66 82,23.5 82,42.95 82.91,43.85 S4.3
BTN_CENTER
  Top 0.178: S6.CTR 75.8,10.3 75.6,10.3 73.65,12.25 72.32,12.25 U5.10
BTN_DOWN
  Top 0.178: S6.D 83.5,16.02 83.5,16.5 81.54,18.46 75.8,18.46 73.39,16.04 U5.13
BTN_LEFT
  Top 0.178: U5.5 65.58,12.23 64.49,11.14 64.49,9.25 65.25,8.5 75.98,8.5 S6.C
BTN_RIGHT
  Top 0.178: U5.12 72.62,14.77 75.95,18.1 79.1,18.1 S6.B
BTN_UP
  Top 0.178: U5.11 74.3,13.5 S6.A
D/C  (via drill 0.38)
  Top 0.178: v35.1,45 v32.2,45 | TP14.P$1 25.65,31.75 v23.75,33.65
  Bottom 0.178: J3.30 v23.75,33.65 v35.1,45 | v32.2,45 32.55,45.35 32.55,51.46 31.7,52.31 30.69,52.31 30,53 30,55 29.68,55.31 U1.18
  other vias: 25.67,31.75
DAC-DAT  (via drill 0.38)
  Top 0.178: U4.14 68.4,41.75 68.12,41.47 68.12,40.22 67.34,39.44 59,39.44 50.65,47.8 50.65,51.6 54.38,55.33 55.32,55.33 v55.35,55.3
  Bottom 0.178: v55.35,55.3 55.37,55.31 U1.40 57.72,55.31 TP11.P$1
DAC-LRC  (via drill 0.38)
  Top 0.178: v51.55,48 51.55,47.4 59.15,39.8 66.82,39.8 67.51,40.5 v67.51,41.8 67.97,42.25 U4.13 | U4.15 68.9,41.25 v68.76,41.11 v68.76,41.1
  Bottom 0.178: U1.35 v51.55,48 52.56,46.99 TP9.P$1 | v68.76,41.1 v68.76,41.12 68.08,41.8 v67.51,41.8
GND  (via drill 0.38)
  Bottom 0.178: J3.7 20.75,22.15 21,21.9 20.75,21.65 J3.6 | J3.5 20.85,21.15 21.05,20.95 20.75,20.65 J3.4
  other vias: 71,41.5 73,41.5 73,43.5 66.49,40.5 69.9,38 70.99,48.75 69.35,45 12.2,52.45 76.25,3.65 63,33.5 70.7,34.8 77,32.5 78,19.5 69.7,18.8 84,12.5 64,5.5 54,2.5 59,3.5 72,23.5 79.7,19.4 25,53 32.5,53 21,46 12.27,32.9 4,27 22,20.9 23,29.9 32,31.46 46,47 55,20 59,24 53,22 52,14 63,31 64,30 71,43.5 72,42.5 74,39.3 67.39,44.5 62.79,43.6 74.8,51.29 64.64,50.02
  pour Top: 0,0 85,0 85,56 0,56
  pour Bottom (isolate 0.012): 85,0 0,0 0,56 85,56
LED_DATA  (via drill 0.38)
  Top 0.178: D1.4 58.09,5.61 v58.09,6.35 58.09,36.77 47.75,47.11 v47.75,55.3
  Bottom 0.178: v47.75,55.3 47.73,55.31 U1.32 | TP7.P$1 59.35,7.62 v58.09,6.35
LEFTMIC
  Top 0.178: C1.2 68.95,5.7 U2.1
MICBIAS  (via drill 0.38)
  Top 0.178: U2.5 69.62,2.4 | 69.62,2.4 68.85,1.63 C10.1 | 73.75,45.35 74,45.6 C9.2 | 73.75,45.35 72.95,46.15 v72.95,46.55 72.95,52.55 72.76,52.74 71.34,52.74 70.8,52.2 70.8,51.6 | U4.1 73.75,45.35 | 69.62,2.4 69.62,2.38 v70,2 | C11.1 70.02,49.32 70.8,50.1 70.8,51.6 | U3.5 70.77,51.57 70.8,51.6
  Bottom 0.178: v72.95,46.55 72.95,46.05 76.35,42.65 76.35,5.35 73,2 v70,2
MISO  (via drill 0.38)
  Top 0.178: v73.6,9.7 U5.8
  Bottom 0.178: J2.1 73.6,13.21 v73.6,9.7
N$1
  Top 0.178: D3.2 34.1,1.9 30.9,5.1 D4.4
N$2
  Top 0.178: D4.2 25.1,1.9 21.9,5.1 D5.4
N$3
  Top 0.178: D5.2 16.1,1.9 12.9,5.1 D6.4
N$4  (via drill 0.38)
  Top 0.178: Q2.3 60,36 v59,35
  Bottom 0.178: v59,35 43.9,35 31.55,22.65 J3.8
N$6
  Top 0.178: U4.25 74.55,40.75 74.65,40.65 74.65,29.4 68.95,23.7 LS2.+
N$8
  Top 0.178: D1.2 52.1,1.9 48.9,5.1 D2.4
N$9
  Top 0.178: D2.2 43.1,1.9 39.9,5.1 D3.4
N$11
  Top 0.178: U4.11 68.65,43.25 68.45,43.45 Y1.3
N$16
  Top 0.178: R2.2 70.95,1.5 70.8,1.65 70.8,4.4 71.4,5 I2C.3
N$17
  Top 0.178: R3.2 71.65,3.65 72,4 74.3,4 74.52,4.22 I2C.1
N$22
  Top 0.178: U4.23 73.25,39.09 73.4,38.94 73.4,38.48 73.7,38.18 73.7,36 69,31.3 LS2.-
N$29  (via drill 0.38)
  Top 0.178: v72.4,45.6 72.25,45.45 U4.4 | C1.1 75,7.55 v75.02,7.57
  Bottom 0.178: v72.4,45.6 75.95,42.05 75.95,8.5 v75.02,7.57
N$30
  Top 0.178: U4.5 71.75,47.4 72,47.65 C2.1
N$38
  Top 0.178: U4.27 76.55,41.75 77.5,40.8 C8.2
RIGHTMIC
  Top 0.178: C2.2 71,53.62 70.65,53.97 U3.1
SCK  (via drill 0.38)
  Top 0.178: v23.39,35.3 30.75,35.3 TP5.P$1
  Bottom 0.178: J3.33 23.13,35.15 23.27,35.3 v23.39,35.3 36.31,48.21 U1.23
  other vias: 31.75,34.29
SCL  (via drill 0.38)
  Top 0.178: J2.3 70.77,12.23 72.04,10.96 U5.9 | v66,22.5 66,35.5 70.25,39.75 U4.17 | v56.65,8.95 20.93,8.95 14,15.88 v14,47 | R2.1 74.45,2.6 76.8,2.6 77.47,1.94 v78.8,1.94 80,3.13 J1.4
  Bottom 0.178: v78.8,1.94 77.72,0.85 58.55,0.85 56.66,2.74 v56.66,8.95 | v56.66,8.95 v56.65,8.95 | U1.5 13.45,47.55 v14,47 14,46.96 TP1.P$1 | J2.3 69.97,12.7 66.04,12.7 | 66.04,12.7 58.42,12.7 56.66,10.94 v56.66,8.95 | 66.04,12.7 66,12.74 v66,22.5
SDA  (via drill 0.38)
  Top 0.178: J2.4 69,12.73 69,10 v68.69,9.69 U5.7 | U4.18 70.75,39.75 66.8,35.8 v66.8,25 | v11,47 11,15.88 18.88,8 v56,8 57.28,8 v57.4,7.87 | J1.3 79,3.2 v78.8,3 R3.1
  Bottom 0.178: v66.8,25 66.8,14.7 68,13.5 J2.4 | v56,8 | v56,8 56,2.9 58.45,0.44 78.34,0.44 80.53,2.63 80.53,3.46 80.3,3.7 79.5,3.7 v78.8,3 | U1.3 10.91,47.09 v11,47 12.28,45.72 TP2.P$1 | v68.69,9.69 59.22,9.69 v57.4,7.87
SDI
  Bottom 0.178: J3.39 21.86,38.15 | 21.86,38.15 23.75,38.15 31.23,45.63 U1.19 | TP3.P$1 21.86,38.15
SDO  (via drill 0.38)
  Top 0.178: v37,46 v33.2,46
  Bottom 0.178: J3.28 19.66,32.71 23.13,32.71 | v33.2,46 33.77,46.57 U1.21 | 23.13,32.71 23.71,32.71 v37,46 | TP4.P$1 23.13,32.71

### Text on the board
Bottom: v10
Measures: Units in mm
tDocu: Andy England